# Altium project ESP12F-1.PrjPcb
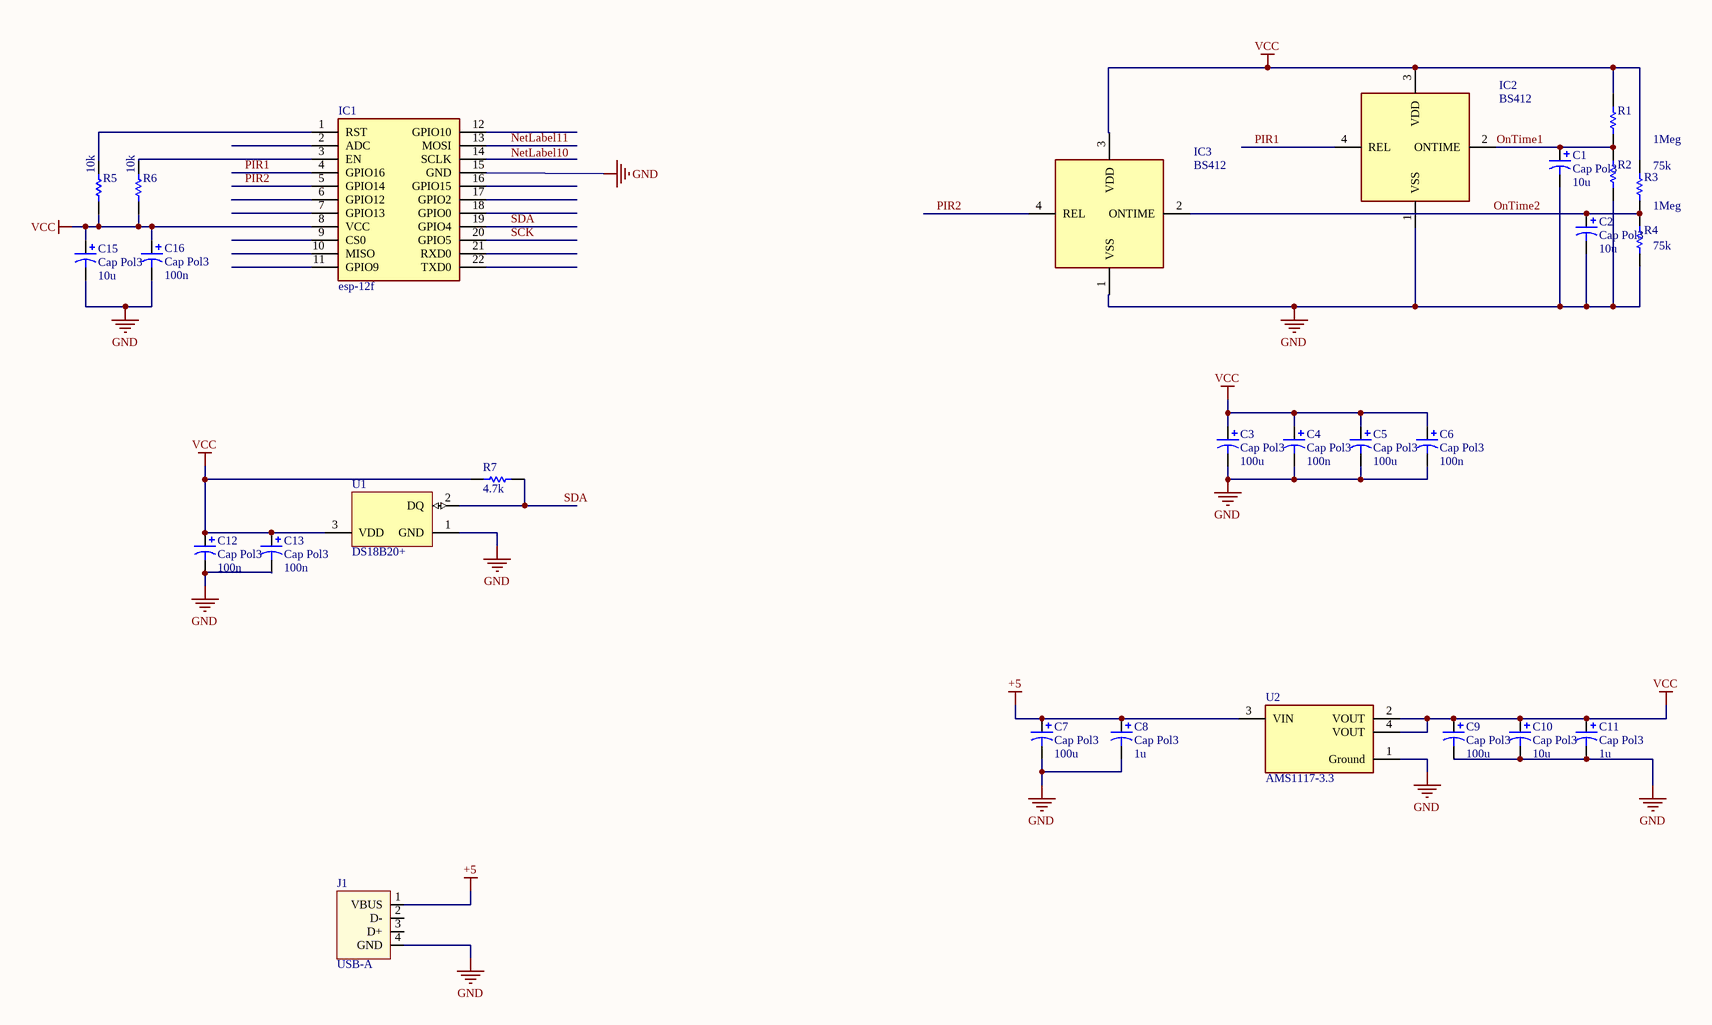
[diagram p0: esp12f-1.SchDoc]
1 sheet, 28 parts. Net scope: global (net labels, ports and power ports of the same name join across sheets).
Board file: PCB1.PcbDoc

## Sheet esp12f-1.SchDoc
size E; SheetNumber: 1; SheetTotal: 1

### Parts
C1  Cap Pol3  value 10u  [C0805]
C2  Cap Pol3  value 10u  [C0805]
C3  Cap Pol3  value 100u  [C0805]
C4  Cap Pol3  value 100n  [C0805]
C5  Cap Pol3  value 100u  [C0805]
C6  Cap Pol3  value 100n  [C0805]
C7  Cap Pol3  value 100u  [C0805]
C8  Cap Pol3  value 1u  [C0805]
C9  Cap Pol3  value 100u  [C0805]
C10  Cap Pol3  value 10u  [C0805]
C11  Cap Pol3  value 1u  [C0805]
C12  Cap Pol3  value 100n  [C0805]
C13  Cap Pol3  value 100n  [C0805]
C15  Cap Pol3  value 10u  [C0805]
C16  Cap Pol3  value 100n  [C0805]
IC1  esp-12f  [esp12f]
IC2  BS412  [BS412]
IC3  BS412  [BS412]
J1  USB-A  [USB-A-PCB]  (no BOM)
R1  1Meg  [RESC2013X58X38NL25T25]
R2  75k  [RESC2013X58X38NL25T25]
R3  1Meg  [RESC2013X58X38NL25T25]
R4  75k  [RESC2013X58X38NL25T25]
R5  10k  [RESC2013X58X38NL25T25]
R6  10k  [RESC2013X58X38NL25T25]
R7  4.7k  [RESC2013X58X38NL25T25]
U1  DS18B20+  [Q3+1]
U2  AMS1117-3.3  [FP-AMS1117-IPC_C]

### Nets
+5: C7.1 C8.1 J1.1(VBUS) U2.3(VIN)
GND: C1.2 C2.2 C3.2 C4.2 C5.2 C6.2 C7.2 C8.2 C9.2 C10.2 C11.2 C12.2 C13.2 C15.2 C16.2 IC1.15(GND) IC2.1(VSS) IC3.1(VSS) J1.4(GND) R2.2 R4.2 U1.1(GND) U2.1(Ground)
VCC: C3.1 C4.1 C5.1 C6.1 C9.1 C10.1 C11.1 C12.1 C13.1 C15.1 C16.1 IC1.8(VCC) IC2.3(VDD) IC3.3(VDD) R1.2 R3.2 R5.2 R6.2 R7.1 U1.3(VDD) U2.2(VOUT) U2.4(VOUT)
NetLabel11: IC1.13(MOSI)
OnTime1: C1.1 IC2.2(ONTIME) R1.1 R2.1
OnTime2: C2.1 IC3.2(ONTIME) R3.1 R4.1
PIR1: IC1.4(GPIO16) IC2.4(REL)
PIR2: IC1.5(GPIO14) IC3.4(REL)
SCK: IC1.20(GPIO5)
SDA: IC1.19(GPIO4) R7.2 U1.2(DQ)
NetIC1_1: IC1.1(RST) R5.1
NetIC1_3: IC1.3(EN) R6.1

Not connected (* = marked no-connect by the designer): IC1 2(ADC) 6(GPIO12) 7(GPIO13) 9(CS0) 10(MISO) 11(GPIO9) 12(GPIO10) 14(SCLK) 16(GPIO15) 17(GPIO2) 18(GPIO0) 21(RXD0) 22(TXD0); J1 2(D-) 3(D+)

### Notes on the sheet
- Labels drawn without touching a wire or pin: NetLabel10

### Library data of the parts
C1-C13 C15 C16 = Cap Pol3: Polarized Capacitor (Surface Mount); Published: 8-Jun-2000; LatestRevisionDate: 29-May-2009; LatestRevisionNote: IPC-7351 Footprint Added.; PackageReference: C0805; Publisher: Altium Limited; PackageDescription: Chip Capacitor
IC1 = esp-12f: Integrated Circuit; Manufacturer_Name: Ai-Thinker; Datasheet Link: https://docs.ai-thinker.com/_media/esp8266/docs/esp-12f_product_specification_en.pdf; Height: 3.1mm; Manufacturer_Part_Number: esp-12f
IC2 IC3 = BS412: Integrated Circuit; Manufacturer_Name: Senba Sensing Tech; Datasheet Link: https://datasheet.lcsc.com/szlcsc/1910111742_Senba-Sensing-Tech-BS412_C410378.pdf; Height: 4.2mm; Manufacturer_Part_Number: BS412
J1 = USB-A-PCB: USB-A PCB footprint; Artikkelnr Noca: N.A.; Part Number: USB-A-PCB; Manufacturer: *; Manufacturer Part Number: *; LatestRevisionDate: 2014-06-04; Pin Count: 4; Publisher: Nordic Semiconductor; Published: 2014-06-04; Value: USB-A; Note: *; Footprint Doc: USB-A-PCB; ComponentLink1Description: Datasheet; ComponentLink1URL: *; ComponentLink2Description: Supplier link; ComponentLink2URL: *; HelpURL: *; Part number IPS: N.A.; Supplier 1: *; Supplier Part Number 1: *; Supplier 2: *; Supplier Part Number 2: *
R1-R7 = CMP-2001-04325-1: Part Number: WSLP0805R0400FEA; Manufacturer: Vishay Dale
U1 = CMP-0253-00003-1: Programmable Resolution Digital Thermometer, 1-Wire Interface, ±0.5°C Accuracy, 3-Pin TO92, -55°C to +125°C, Pb-Free; ComponentLink2URL: http://datasheets.maxim-ic.com/en/ds/DS18B20.pdf; PackageReference: Q3+1; ComponentLink1Description: Manufacturer URL; PackageDescription: TO-92 Package, Body Dia. 4.7mm; Leads 0.51 x 0.51 mm (max), Pb-Free; DatasheetVersion: 2007; Code_JEDEC: TO-226-AA; ComponentLink1URL: http://www.maxim-ic.com; PackageVersion: revB, 2009; ComponentLink2Description: Datasheet
U2 = CMP-209535-000001-1: LDO Voltage Regulators 1A, 3.3V; Manufacturer: Advanced Monolithic Systems; Dropout Voltage: 1.1V; Output Type: Fixed; Nominal Supply Current: 5mA; Max Power Dissipation: 1.2W; Max Supply Voltage: 15V; Number Of Outputs: 1; Standoff Height: 0.64mm; Max Junction Temp: +125°C; Height: 1.8mm; Package: AMS1117; Device Class L2: Power Management ICs; ComponentLink2Description: Datasheet; ComponentLink2URL: http://www.advanced-monolithic.com/pdf/ds1117.pdf; Category: IC; RoHS: TRUE; Automotive: No; Device Class L1: Integrated Circuits (ICs); Output Current: 1A; Device Class L3: Voltage Regulators - Linear; Temperature: -40°C to +125°C; Output Voltage: 3.3V; Manufacturer Part Number: AMS1117-3.3; Temperature Range Low: -40°C; Octopart: https://octopart.com/ams1117-3.3-advanced+monolithic+systems-25899300; Lead Free: Yes; Ipc Land Pattern Name: SOT229P700X180-4; Temperature Range High: +125°C